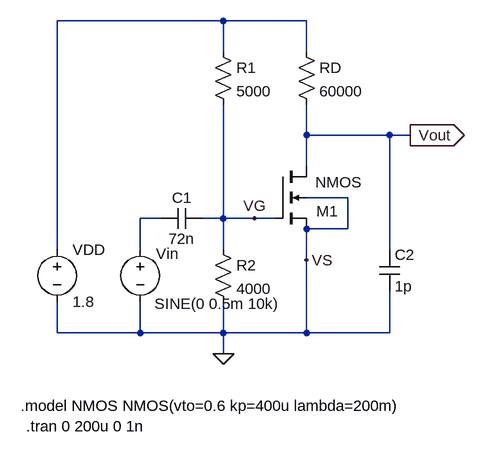
[diagram p0: schematic HW4 1-b.asc]
HW4 1-b.asc, the LTspice schematic file:
Version 4
SHEET 1 880 680
WIRE 208 -240 -48 -240
WIRE 336 -240 208 -240
WIRE 208 -192 208 -240
WIRE 336 -192 336 -240
WIRE 336 -64 336 -112
WIRE 464 -64 336 -64
WIRE 496 -64 464 -64
WIRE 336 -16 336 -64
WIRE 400 32 336 32
WIRE 112 64 80 64
WIRE 208 64 208 -112
WIRE 208 64 176 64
WIRE 256 64 208 64
WIRE 288 64 256 64
WIRE 400 80 400 32
WIRE 400 80 336 80
WIRE -48 112 -48 -240
WIRE 80 112 80 64
WIRE 208 112 208 64
WIRE 464 112 464 -64
WIRE 336 128 336 80
WIRE -48 240 -48 192
WIRE 80 240 80 192
WIRE 80 240 -48 240
WIRE 208 240 208 192
WIRE 208 240 80 240
WIRE 336 240 336 128
WIRE 336 240 208 240
WIRE 464 240 464 176
WIRE 464 240 336 240
WIRE 208 272 208 240
FLAG 208 272 0
FLAG 496 -64 Vout
IOPIN 496 -64 Out
FLAG 256 64 VG
FLAG 336 128 VS
SYMBOL nmos4 288 -16 R0
WINDOW 0 63 69 Left 2
WINDOW 3 62 24 Left 2
SYMATTR InstName M1
SYMATTR Value2 l=0.18u w=0.25u
SYMBOL res 192 96 R0
SYMATTR InstName R2
SYMATTR Value 4000
SYMBOL cap 448 112 R0
SYMATTR InstName C2
SYMATTR Value 1p
SYMBOL res 320 -208 R0
SYMATTR InstName RD
SYMATTR Value 60000
SYMBOL res 192 -208 R0
SYMATTR InstName R1
SYMATTR Value 5000
SYMBOL voltage -48 96 R0
SYMATTR InstName VDD
SYMATTR Value 1.8
SYMBOL voltage 80 96 R0
WINDOW 123 23 99 Left 2
WINDOW 39 0 0 Left 0
WINDOW 0 24 22 Left 2
WINDOW 3 22 99 Left 2
SYMATTR InstName Vin
SYMATTR Value SINE(0 0.5m 10k)
SYMBOL cap 176 48 R90
WINDOW 0 0 32 VBottom 2
WINDOW 3 32 32 VTop 2
SYMATTR InstName C1
SYMATTR Value 72n
TEXT -104 352 Left 2 !.model NMOS NMOS(vto=0.6 kp=400u lambda=200m)
TEXT -96 384 Left 2 !.tran 0 200u 0 1n

The netlist it stands for:
* HW4 1-b.asc
M1 Vout VG 0 0 NMOS l=0.18u w=0.25u
R2 VG 0 4000
C2 Vout 0 1p
RD N001 Vout 60000
R1 N001 VG 5000
VDD N001 0 1.8
Vin N002 0 SINE(0 0.5m 10k)
C1 VG N002 72n
.model NMOS NMOS
.model PMOS PMOS
.lib standard.mos
.model NMOS NMOS(vto=0.6 kp=400u lambda=200m)
.tran 0 200u 0 1n
.backanno
.end